# EAGLE design wordclock_v1_9 (EAGLE 7.5.0)

## Sheet 1 of 2
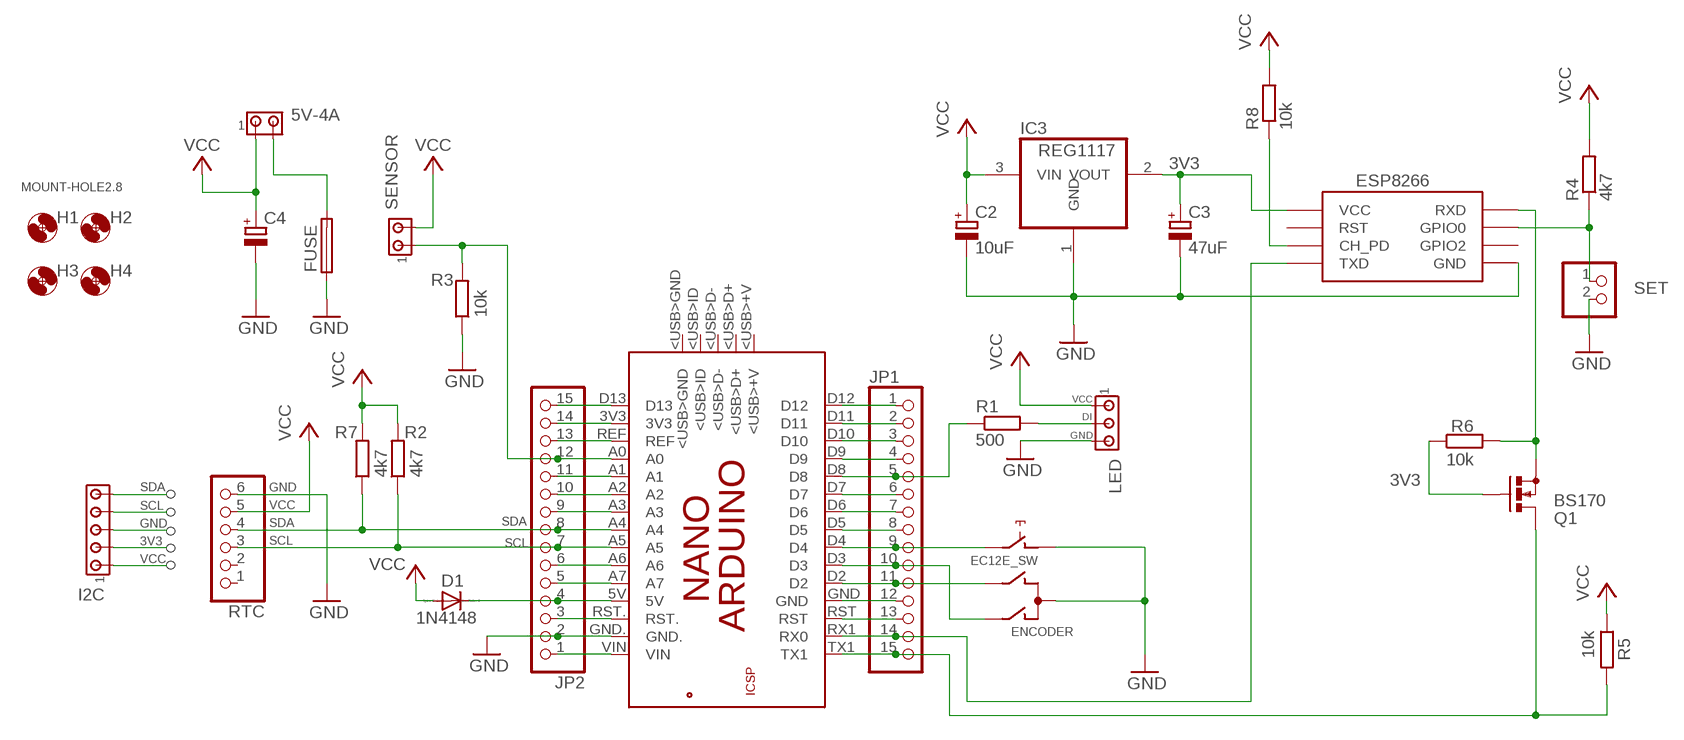
[diagram p0: schematic, sheet 1]

### Parts
5V-4A  5V-4A  MTA02-156  [1X2MTA]
C2  10uF  CPOL-EUB45181A  [B45181A]
C3  47uF  CPOL-EUB45181A  [B45181A]
C4  CPOL-EUE5-10.5  [E5-10,5]
D1  1N4148  1N4148DO35-10  [DO35-10]
ENCODER  EC12E_SW  [ALPS_EC12E_SW]
ESP8266  ESP01  [ESP01]
FUSE  FUSELITTLEFUSE  [LITTLEFUSE]
H1  MOUNT-HOLE2.8  [2,8]
H2  MOUNT-HOLE2.8  [2,8]
H3  MOUNT-HOLE2.8  [2,8]
H4  MOUNT-HOLE2.8  [2,8]
I2C  MTA05-100  [10X05MTA]
IC3  REG1117  [SOT223]
JP1  PINHD-1X15  [1X15]
JP2  PINHD-1X15  [1X15]
LED  MTA03-156  [1X3MTA]
PCB2  ARDUINO_NANO  [ARDUINO_NANO]
Q1  BS170  [SOT54E]
R1  500  R-EU_0207/7  [0207/7]
R2  4k7  R-EU_0207/10  [0207/10]
R3  10k  R-EU_0207/10  [0207/10]
R4  4k7  R-EU_0207/10  [0207/10]
R5  10k  R-EU_0207/10  [0207/10]
R6  10k  R-EU_0207/10  [0207/10]
R7  4k7  R-EU_0207/10  [0207/10]
R8  10k  R-EU_0207/10  [0207/10]
RTC  PINHD-1X6  [1X06]
SENSOR  MTA02-156  [1X2MTA]
SET  PINHD-1X2  [1X02]

### Nets
3V3: C3.+ ESP8266.VCC I2C.2 IC3.2(VOUT) Q1.G R6.1
DI: LED.2 R1.2
GND: C2.- C3.- C4.- ENCODER.C ENCODER.D ESP8266.GND FUSE.1 I2C.3 IC3.1(GND) JP2.2 LED.3 PCB2.GND. R3.1 RTC.6 SET.2
N$1: ESP8266.CH_PD R8.1
N$2: JP1.1 PCB2.D12
N$3: JP1.2 PCB2.D11
N$4: JP1.5 PCB2.D8 R1.1
N$5: 5V-4A.2 FUSE.2
N$6: ENCODER.B JP1.11 PCB2.D2
N$7: ENCODER.A JP1.10 PCB2.D3
N$8: ENCODER.E JP1.9 PCB2.D4
N$9: JP1.3 PCB2.D10
N$11: JP1.15 PCB2.TX1 Q1.D R5.2
N$12: D1.C JP2.4 PCB2.5V
N$13: JP2.12 PCB2.A0 R3.2 SENSOR.1
N$14: JP1.4 PCB2.D9
N$15: JP1.6 PCB2.D7
N$18: ESP8266.RX(RXD) Q1.S R6.2
N$19: JP1.7 PCB2.D6
N$20: JP1.8 PCB2.D5
N$21: JP1.12 PCB2.GND
N$22: JP1.13 PCB2.RST
N$23: JP2.15 PCB2.D13
N$24: JP2.14 PCB2.3V3
N$25: JP2.13 PCB2.REF
N$26: JP2.11 PCB2.A1
N$27: JP2.10 PCB2.A2
N$28: JP2.9 PCB2.A3
N$29: JP2.6 PCB2.A6
N$30: JP2.5 PCB2.A7
N$31: JP2.3 PCB2.RST.
N$32: JP2.1 PCB2.VIN
RX: ESP8266.TX(TXD) JP1.14 PCB2.RX1(RX0)
SCL: I2C.4 JP2.7 PCB2.A5 R2.1 RTC.3
SDA: I2C.5 JP2.8 PCB2.A4 R7.1 RTC.4
SET: ESP8266.GPIO0 R4.1 SET.1
VCC: 5V-4A.1 C2.+ C4.+ D1.A I2C.1 IC3.3(VIN) LED.1 R2.2 R4.2 R5.1 R7.2 R8.2 RTC.5 SENSOR.2
Unconnected: ENCODER.GND1(G) ENCODER.GND2(G) ESP8266.GPIO2 ESP8266.RST PCB2.5V. PCB2.<USB>+V PCB2.<USB>D+ PCB2.<USB>D- PCB2.<USB>GND PCB2.<USB>ID PCB2.GND_ PCB2.MISO PCB2.MOSI PCB2.RESET.. PCB2.SCK RTC.1 RTC.2

### Notes on the sheet
- GND
- GND
- VCC
- SDA
- SCL

## Sheet 2 of 2

## Library data of the parts
5V-4A SENSOR = con-amp:MTA02-156: AMP connector
C2-C4 = rcl:CPOL-EU: POLARIZED CAPACITOR, European symbol
D1 = diode:1N4148: DIODE high speed (Philips)
ENCODER = switch-alps:EC12E_SW: ALPS rotary Encoder EC12E series with switch; MPN: EC12E2424407; OC_FARNELL: 1520813; OC_NEWARK: 74M1068
ESP8266 = esp8266modules:ESP01: ESP8266 Wifi module 01
FUSE = fuse:FUSE: Fuse; OC_FARNELL: unknown; OC_NEWARK: unknown
H1-H4 = holes:MOUNT-HOLE: MOUNTING HOLE with drill center marker
I2C = con-amp:MTA05-100: AMP connector
IC3 = burr-brown:REG1117: 800mA and 1A Low Dropout (LDO) Positive Regulator 1.8V, 2.5V, 2.85V, 3.3V, 5V, and Adj; MPN: REG1117; OC_FARNELL: 1097566; OC_NEWARK: 14P6981
JP1 JP2 = PINHD8:90:PINHD-1X15: PIN HEADER
LED = con-amp:MTA03-156: AMP connector
PCB2 = E14_Arduino_revB_2:ARDUINO_NANO: Device for representing an Arduino Nano board with a footprint in an EAGLE design. Created by Dave Young for Element14. More EAGLE documentation at: http://www.element14.com/community/community/knode/cadsoft_eagle
Q1 = transistor-small-signal:BS170: N-CHANNEL MOS FET
R1 = resistor:R-EU_: RESISTOR, European symbol
R2-R8 = rcl:R-EU_: RESISTOR, European symbol
RTC = PINHD8:90:PINHD-1X6: PIN HEADER
SET = pinhead:PINHD-1X2: PIN HEADER

## Board
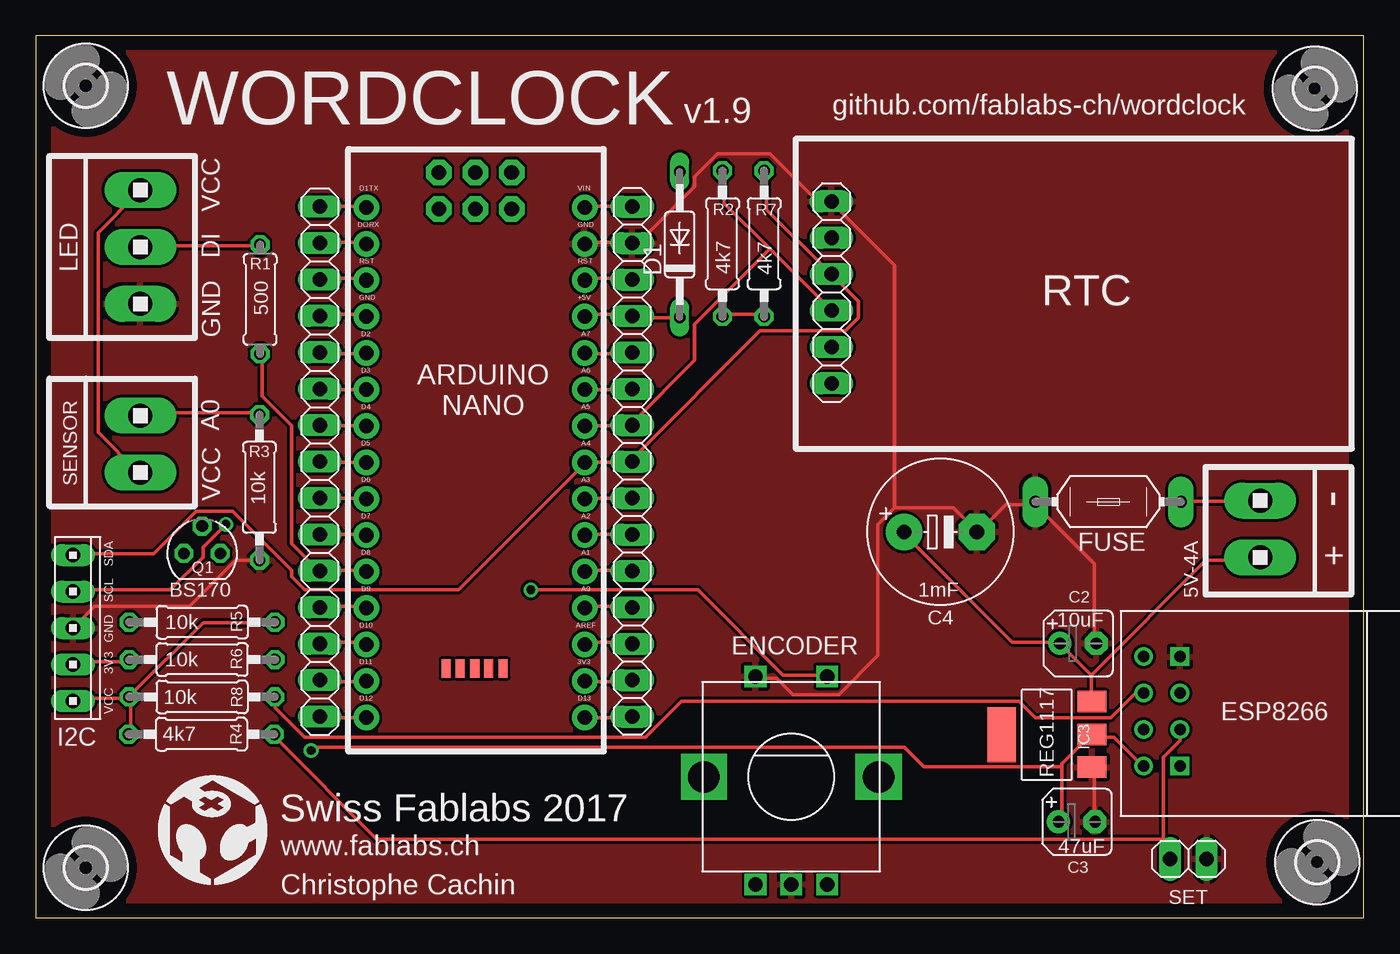
[diagram p1: board, top side]
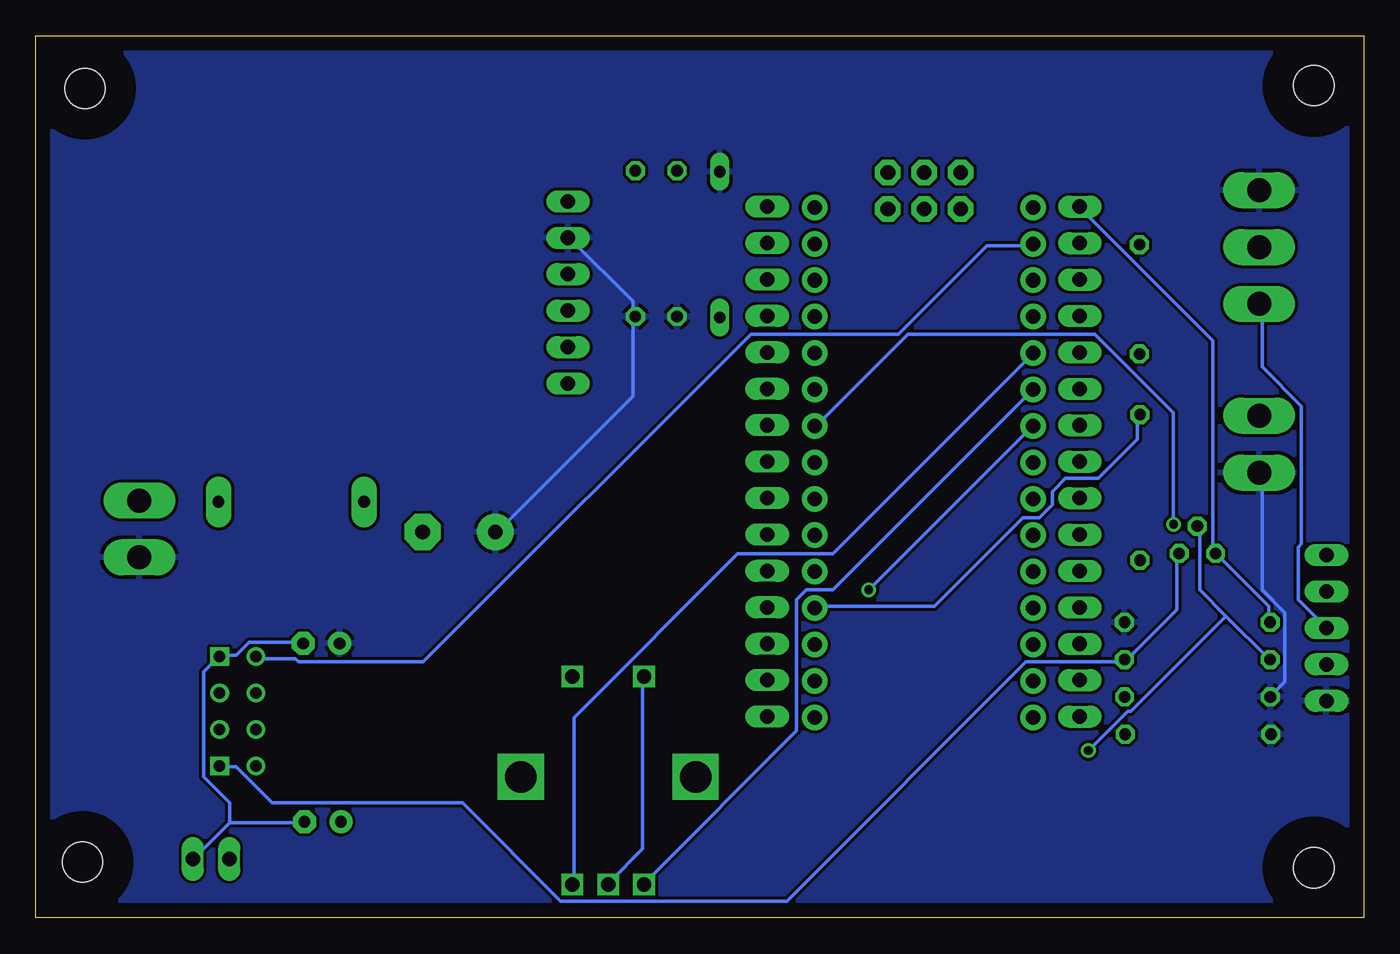
[diagram p2: board, bottom side, seen from below]

Size 92.62 x 61.49 mm. Coordinates in mm from the lower left corner, seen from the top.
Outline: 0,0 92.62,0 92.62,61.49 0,61.49 0,0
Copper layers (1*16): Top 0.035mm / dielectric 1.5mm / Bottom 0.035mm
Design rules "default": minimum track width 10mil, minimum drill 24mil, track to track 8mil, track to pad 8mil, pad to pad 8mil, via to via 8mil, smd to smd 8mil, copper to edge 40mil, drill to drill 8mil, minimum pad ring 10mil, minimum via ring 8mil, stop-mask expansion 4mil, vias tented up to drill 0mil, thermal gap 10mil

### Footprints (pad centres in the part's own frame; a part is rotated, then mirrored left to right if it is on the bottom)
1X2MTA = drill 1.676 long: 1 1.981,0; 2 -1.981,0
B45181A = drill 0.813 pad 1.6: + -1.27,0 | drill 0.813 pad 1.6 octagon: - 1.27,0
E5-10,5 = drill 1.016 pad 2.54: + -2.54,0 | drill 1.016 pad 2.54 octagon: - 2.54,0
DO35-10 = drill 0.813 long: A 5.08,0; C -5.08,0
ALPS_EC12E_SW = drill 1 square: A -2.5,-7.5; B 2.5,-7.5; C 0,-7.5; D -2.5,7; E 2.5,7 | drill 2.2 square: GND1 -6.1,0; GND2 6.1,0
ESP01 = drill 0.8: CH_PD -1.285,-8.178; GPIO0 1.255,-5.638; GPIO2 -1.285,-5.638; RST 1.255,-8.178; TX -3.825,-8.178; VCC 3.795,-8.178 | drill 0.8 square: GND -3.825,-5.638; RX 3.795,-5.638
LITTLEFUSE = drill 0.813 pad 1.778 long: 1 -5.08,0; 2 5.08,0
2,8 = hole 2.8: 0,0
10X05MTA = drill 1.016 long: 1 5.08,0; 2 2.54,0; 3 0,0; 4 -2.54,0; 5 -5.08,0
SOT223 = smd 1.499 x 2.007: 1 -2.261,-3.15; 2 0.025,-3.15; 3 2.311,-3.15 | smd 3.81 x 2.007: 4 0,3.15
1X15 = drill 1.016 long: 1 -17.78,0; 2 -15.24,0; 3 -12.7,0; 4 -10.16,0; 5 -7.62,0; 6 -5.08,0; 7 -2.54,0; 8 0,0; 9 2.54,0; 10 5.08,0; 11 7.62,0; 12 10.16,0; 13 12.7,0; 14 15.24,0; 15 17.78,0
1X3MTA = drill 1.676 long: 1 3.937,0; 2 -0.025,0; 3 -3.988,0
ARDUINO_NANO = drill 1.016 pad 1.778: 3V3 6.35,1.27; 5V 31.75,1.27; A0 11.43,1.27; A1 13.97,1.27; A2 16.51,1.27; A3 19.05,1.27; A4 21.59,1.27; A5 24.13,1.27; A6 26.67,1.27; A7 29.21,1.27; D2 29.21,16.51; D3 26.67,16.51; D4 24.13,16.51; D5 21.59,16.51; D6 19.05,16.51; D7 16.51,16.51; D8 13.97,16.51; D9 11.43,16.51; D10 8.89,16.51; D11 6.35,16.51; D12 3.81,16.51; D13 3.81,1.27; GND 31.75,16.51; GND. 36.83,1.27; REF 8.89,1.27; RST 34.29,16.51; RST. 34.29,1.27; RX1 36.83,16.51; TX1 39.37,16.51; VIN 39.37,1.27 | drill 1.016 pad 1.778 octagon: 5V. 39.268,6.375; GND_ 39.268,11.455; MISO 41.808,6.375; MOSI 39.268,8.915; RESET.. 41.808,11.455; SCK 41.808,8.915 | smd 1.27 x 0.635: <USB>+V 7.214,10.947; <USB>D+ 7.214,9.957; <USB>D- 7.214,8.941; <USB>GND 7.214,6.96; <USB>ID 7.214,7.976
SOT54E = drill 0.813 octagon: D -1.27,0; G 0,1.905; S 1.27,0
0207/7 = drill 0.813 octagon: 1 -3.81,0; 2 3.81,0
0207/10 = drill 0.813 octagon: 1 -5.08,0; 2 5.08,0
1X06 = drill 1.016 long: 1 -6.35,0; 2 -3.81,0; 3 -1.27,0; 4 1.27,0; 5 3.81,0; 6 6.35,0
1X02 = drill 1.016 long: 1 -1.27,0; 2 1.27,0

### Placement (x,y rotation side)
5V-4A  85.4,27.1 270 top
C2  72.7,19.13 0 top
C3  72.61,6.69 0 top
C4  63.1,26.9 0 top
D1  44.91,46.94 90 top
ENCODER  52.69,9.82 0 top
ESP8266  85.44,14.38 270 top
FUSE  74.8,29 0 top
H1  3.48,3.48 0 top
H2  89.37,3.88 0 top
H3  89.2,57.82 0 top
H4  3.48,58.02 90 top
I2C  2.6,20.2 270 top
IC3  70.52,12.76 90 top
JP1  19.8,31.8 90 top
JP2  41.6,31.8 270 top
LED  7.29,46.79 90 top
PCB2  39.56,10.16 90 top
Q1  11.6,25.4 0 top
R1  15.64,43.12 90 top
R2  47.9,47 270 top
R3  15.6,30 90 top
R4  11.55,12.79 180 top
R5  11.6,20.6 180 top
R6  11.6,18 0 top
R7  50.8,47 270 top
R8  11.59,15.39 180 top
RTC  55.5,43.6 90 top
SENSOR  7.29,33.02 90 top
SET  80.4,4.1 0 top

### Tracks (layer width: path | path; a pad name or v marks a point on that pad's centre or on a via)
3V3  (via drill 0.61)
  Top 0.254: ESP8266.VCC 77.04,10.74 75.21,12.57 73.84,12.57 IC3.2 73.61,12.8 71.55,10.74 71.55,10.52 | 71.55,10.52 71.55,6.86 C3.+ | R6.1 6.4,17.83 2.74,17.83 I2C.2 | 71.55,10.52 61.95,10.52 60.58,11.89 19.43,11.89 v19.2,11.66
  Bottom 0.254: 9.6,21.03 6.63,18.06 R6.1 | 9.6,21.03 11.43,22.86 11.43,27.2 Q1.G | v19.2,11.66 16.46,14.4 16.23,14.4 9.6,21.03
DI
  Top 0.254: R1.2 15.54,46.86 7.32,46.86 LED.2
GND
  Top 0.254: R3.1 15.54,24.92 13.95,24.92 10.74,21.72 4.12,21.72 2.74,20.34 I2C.3 | PCB2.GND. 38.41,47.09 41.38,47.09 JP2.2 41.6,47.09 42.06,47.09 45.95,50.98 45.95,51.66 47.55,53.26 51.21,53.26 54.41,50.06 55.32,50.06 RTC.6 55.55,49.84 59.89,45.49 59.89,28.57 | IC3.1 73.84,10.29 73.84,6.86 C3.- | C2.- 73.84,19.2 73.84,24.69 69.72,28.8 FUSE.1 69.49,28.8 67.67,28.8 65.84,26.98 C4.- 65.61,26.98 64.01,28.57 59.89,28.57 | 59.89,28.57 58.75,27.43 58.75,18.29 56.01,15.54 52.81,15.54 51.66,16.69 50.29,16.69 ENCODER.D
  Bottom 0.254: LED.3 7.09,42.75 7.09,38.41 4.34,35.66 4.34,26.06 4.57,25.83 4.57,22.17 2.74,20.34 I2C.3 | ENCODER.D 50.29,16.69 50.29,4.8 52.58,2.52 ENCODER.C | 79.1,6.63 81.61,4.12 SET.2 | 79.1,6.63 74.07,6.63 C3.- | C2.- 74.07,19.2 77.72,19.2 78.64,18.29 79.78,18.29 ESP8266.GND 80.01,18.06 80.92,17.14 80.92,9.83 79.1,8 79.1,6.63
  pour Top: 1,61 1,1 92,1 92,61
N$1
  Top 0.254: ESP8266.CH_PD 77.04,15.54 76.58,15.54 74.98,13.95 69.72,13.95 68.58,15.09 45.03,15.09 42.52,12.57 18.75,12.57 16.69,14.63 16.69,15.32 R8.1
N$2
  Top 0.254: JP1.1 19.89,13.95 22.86,13.95 PCB2.D12
N$3
  Top 0.254: JP1.2 19.89,16.46 22.86,16.46 PCB2.D11
N$4
  Top 0.254: R1.1 15.77,39.09 15.77,36.35 17.83,34.29 17.83,26.06 19.66,24.23 JP1.5 19.89,24.23 22.86,24.23 PCB2.D8
N$5
  Top 0.254: FUSE.2 80.01,29.03 85.27,29.03 5V-4A.2
N$6
  Top 0.254: JP1.11 19.89,39.32 22.86,39.32 PCB2.D2
  Bottom 0.254: ENCODER.B 55.09,2.52 55.09,13.95 43.66,25.38 37.03,25.38 23.09,39.32 PCB2.D2
N$7
  Top 0.254: JP1.10 19.89,36.8 22.86,36.8 PCB2.D3
  Bottom 0.254: ENCODER.A 50.06,2.52 39.55,13.03 39.55,22.17 38.86,22.86 37.03,22.86 23.09,36.8 PCB2.D3
N$8  (via drill 0.61)
  Top 0.254: v34.52,22.86 46.18,22.86 52.12,16.92 55.09,16.92 ENCODER.E | PCB2.D4 19.89,34.29 JP1.9
  Bottom 0.254: v34.52,22.86 23.09,34.29 PCB2.D4
N$9
  Top 0.254: JP1.3 19.89,19.2 22.86,19.2 PCB2.D10
N$11
  Top 0.254: JP1.15 19.89,49.61 22.86,49.61 PCB2.TX1
  Bottom 0.254: R5.2 6.63,20.8 6.63,21.72 10.29,25.38 Q1.D 10.52,25.6 10.52,40.23 19.66,49.38 JP1.15
N$12
  Top 0.254: D1.C 44.81,41.83 41.6,41.83 JP2.4 41.38,42.06 38.41,42.06 PCB2.5V
N$13
  Top 0.254: JP2.12 41.38,21.72 38.41,21.72 PCB2.A0 | R3.2 15.54,35.2 7.32,35.2 SENSOR.1
  Bottom 0.254: PCB2.A0 38.18,21.72 29.95,21.72 23.77,27.89 22.63,27.89 21.72,28.8 21.72,29.72 20.8,30.63 18.52,30.63 15.77,33.38 15.77,34.98 R3.2
N$14
  Top 0.254: JP1.4 19.89,21.72 22.86,21.72 PCB2.D9
N$15
  Top 0.254: JP1.6 19.89,26.75 22.86,26.75 PCB2.D7
N$18
  Bottom 0.254: ESP8266.RX 79.78,10.52 78.64,10.52 76.12,8 62.87,8 56.01,1.14 40.23,1.14 23.55,17.83 16.69,17.83 R6.2 16.46,18.06 13.03,21.49 13.03,25.38 Q1.S
N$19
  Top 0.254: JP1.7 19.89,29.26 22.86,29.26 PCB2.D6
N$20
  Top 0.254: JP1.8 19.89,31.77 22.86,31.77 PCB2.D5
N$21
  Top 0.254: JP1.12 19.89,42.06 22.86,42.06 PCB2.GND
N$22
  Top 0.254: JP1.13 19.89,44.58 22.86,44.58 PCB2.RST
N$23
  Top 0.254: JP2.15 41.38,13.95 38.41,13.95 PCB2.D13
N$24
  Top 0.254: JP2.14 41.38,16.46 38.41,16.46 PCB2.3V3
N$25
  Top 0.254: JP2.13 41.38,19.2 38.41,19.2 PCB2.REF
N$26
  Top 0.254: JP2.11 41.38,24.23 38.41,24.23 PCB2.A1
N$27
  Top 0.254: JP2.10 41.38,26.75 38.41,26.75 PCB2.A2
N$28
  Top 0.254: JP2.9 41.38,29.26 38.41,29.26 PCB2.A3
N$29
  Top 0.254: JP2.6 41.38,36.8 38.41,36.8 PCB2.A6
N$30
  Top 0.254: JP2.5 41.38,39.32 38.41,39.32 PCB2.A7
N$31
  Top 0.254: JP2.3 41.38,44.58 38.41,44.58 PCB2.RST.
N$32
  Top 0.254: JP2.1 41.38,49.61 38.41,49.61 PCB2.VIN
RX
  Top 0.254: JP1.14 19.89,47.09 22.86,47.09 PCB2.RX1
  Bottom 0.254: ESP8266.TX 77.04,18.06 74.52,18.06 74.3,17.83 65.61,17.83 42.75,40.69 32.46,40.69 26.29,46.86 23.09,46.86 PCB2.RX1
SCL  (via drill 0.61)
  Top 0.254: 51.21,46.63 55.32,42.52 RTC.3 | 51.21,46.63 48.01,49.84 48.01,51.89 R2.1 | v13.26,27.43 11.66,25.83 11.66,25.15 9.37,22.86 2.74,22.86 I2C.4 | PCB2.A5 41.38,34.29 JP2.7 41.6,34.52 45.95,38.86 45.95,41.38 51.21,46.63
  Bottom 0.254: v13.26,27.43 13.26,35.2 18.75,40.69 31.77,40.69 38.18,34.29 PCB2.A5
SDA
  Top 0.254: R7.1 50.98,51.89 50.98,49.38 55.32,45.03 RTC.4 55.55,44.81 57.38,42.98 57.38,41.83 56.46,40.92 50.52,40.92 41.6,32 JP2.8 41.38,31.77 38.41,31.77 PCB2.A4 38.18,31.55 29.49,22.86 18.75,22.86 17.83,23.77 17.83,24.23 13.72,28.35 11.2,28.35 8.23,25.38 2.74,25.38 I2C.5
SET
  Top 0.254: 78.64,5.49 78.64,4.57 79.1,4.12 SET.1 | 78.64,5.49 78.64,11.2 79.78,12.34 79.78,13.03 ESP8266.GPIO0 | 78.64,5.49 23.77,5.49 16.69,12.57 R4.1
VCC
  Top 0.254: R4.2 6.63,12.8 6.63,15.32 R8.2 | R5.1 16.46,20.57 11.66,20.57 6.63,15.54 R8.2 | I2C.1 2.74,15.32 6.4,15.32 R8.2 | LED.1 7.09,50.52 4.34,47.78 4.34,33.83 7.09,31.09 SENSOR.2 | R2.2 48.01,42.06 50.75,42.06 R7.2 | 73.61,16.92 73.61,15.09 IC3.3 | 73.61,16.92 71.55,18.97 C2.+ 71.32,19.2 68.12,19.2 60.58,26.75 C4.+ | 73.61,16.92 81.61,24.92 85.27,24.92 5V-4A.1
  Bottom 0.254: SENSOR.2 7.09,30.86 7.09,22.86 5.49,21.26 5.49,16.46 6.4,15.54 R8.2 | RTC.5 55.32,47.32 50.98,42.98 50.98,42.06 R7.2 50.98,41.83 50.98,36.35 60.35,26.98 C4.+ | 7.32,50.75 LED.1
  pour Bottom: 1,61 1,1 92,1 92,61

### Text on the board
tPlace: github.com/fablabs-ch/wordclock | WORDCLOCK | v1.9 | VCC | 4k7 | 4k7 | DI | RTC | 500 | GND | ARDUINO / NANO | A0 | VCC | 10k | - | SDA | + | BS170 | 1mF | SCL | 10k | 10uF | GND | 10k | 3V3 | 10k | VCC | 4k7 | REG1117 | Swiss Fablabs 2017 | www.fablabs.ch | 47uF | Christophe Cachin | SET